# EAGLE design moire_v1.2_rt (EAGLE 9.2.0)

## Sheet 1 of 2
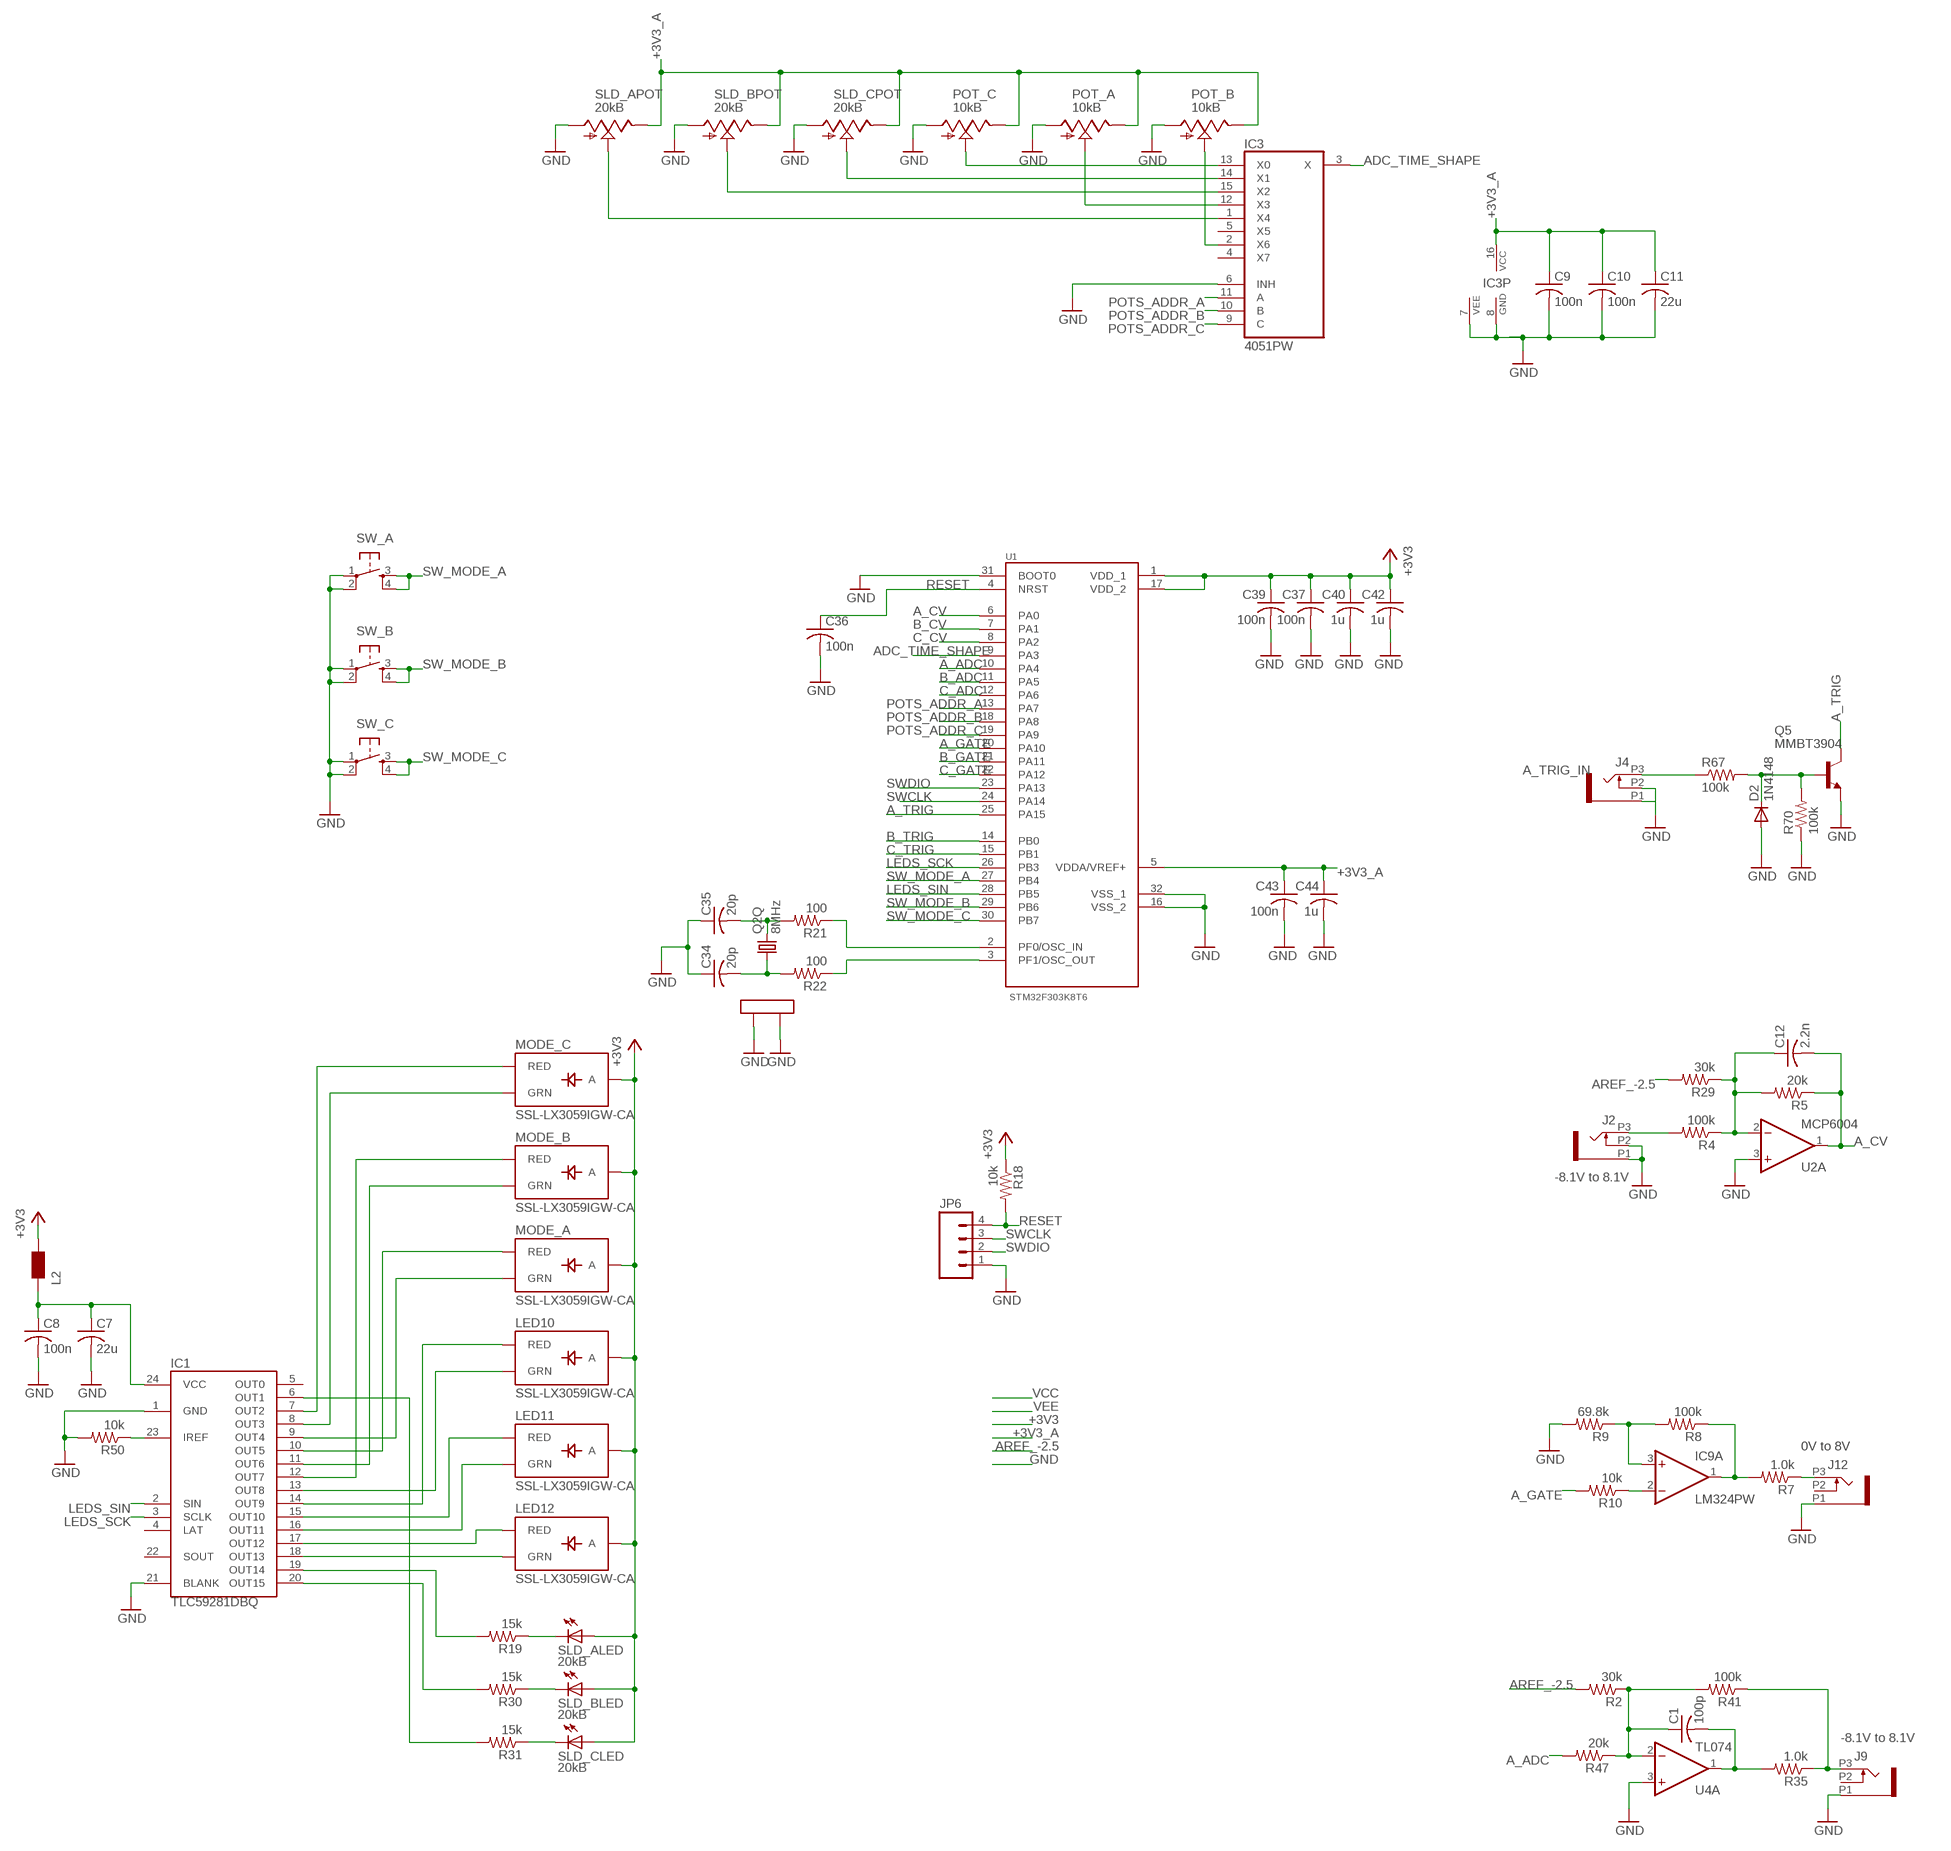
[diagram p0: schematic, sheet 1, part 1 of 2]
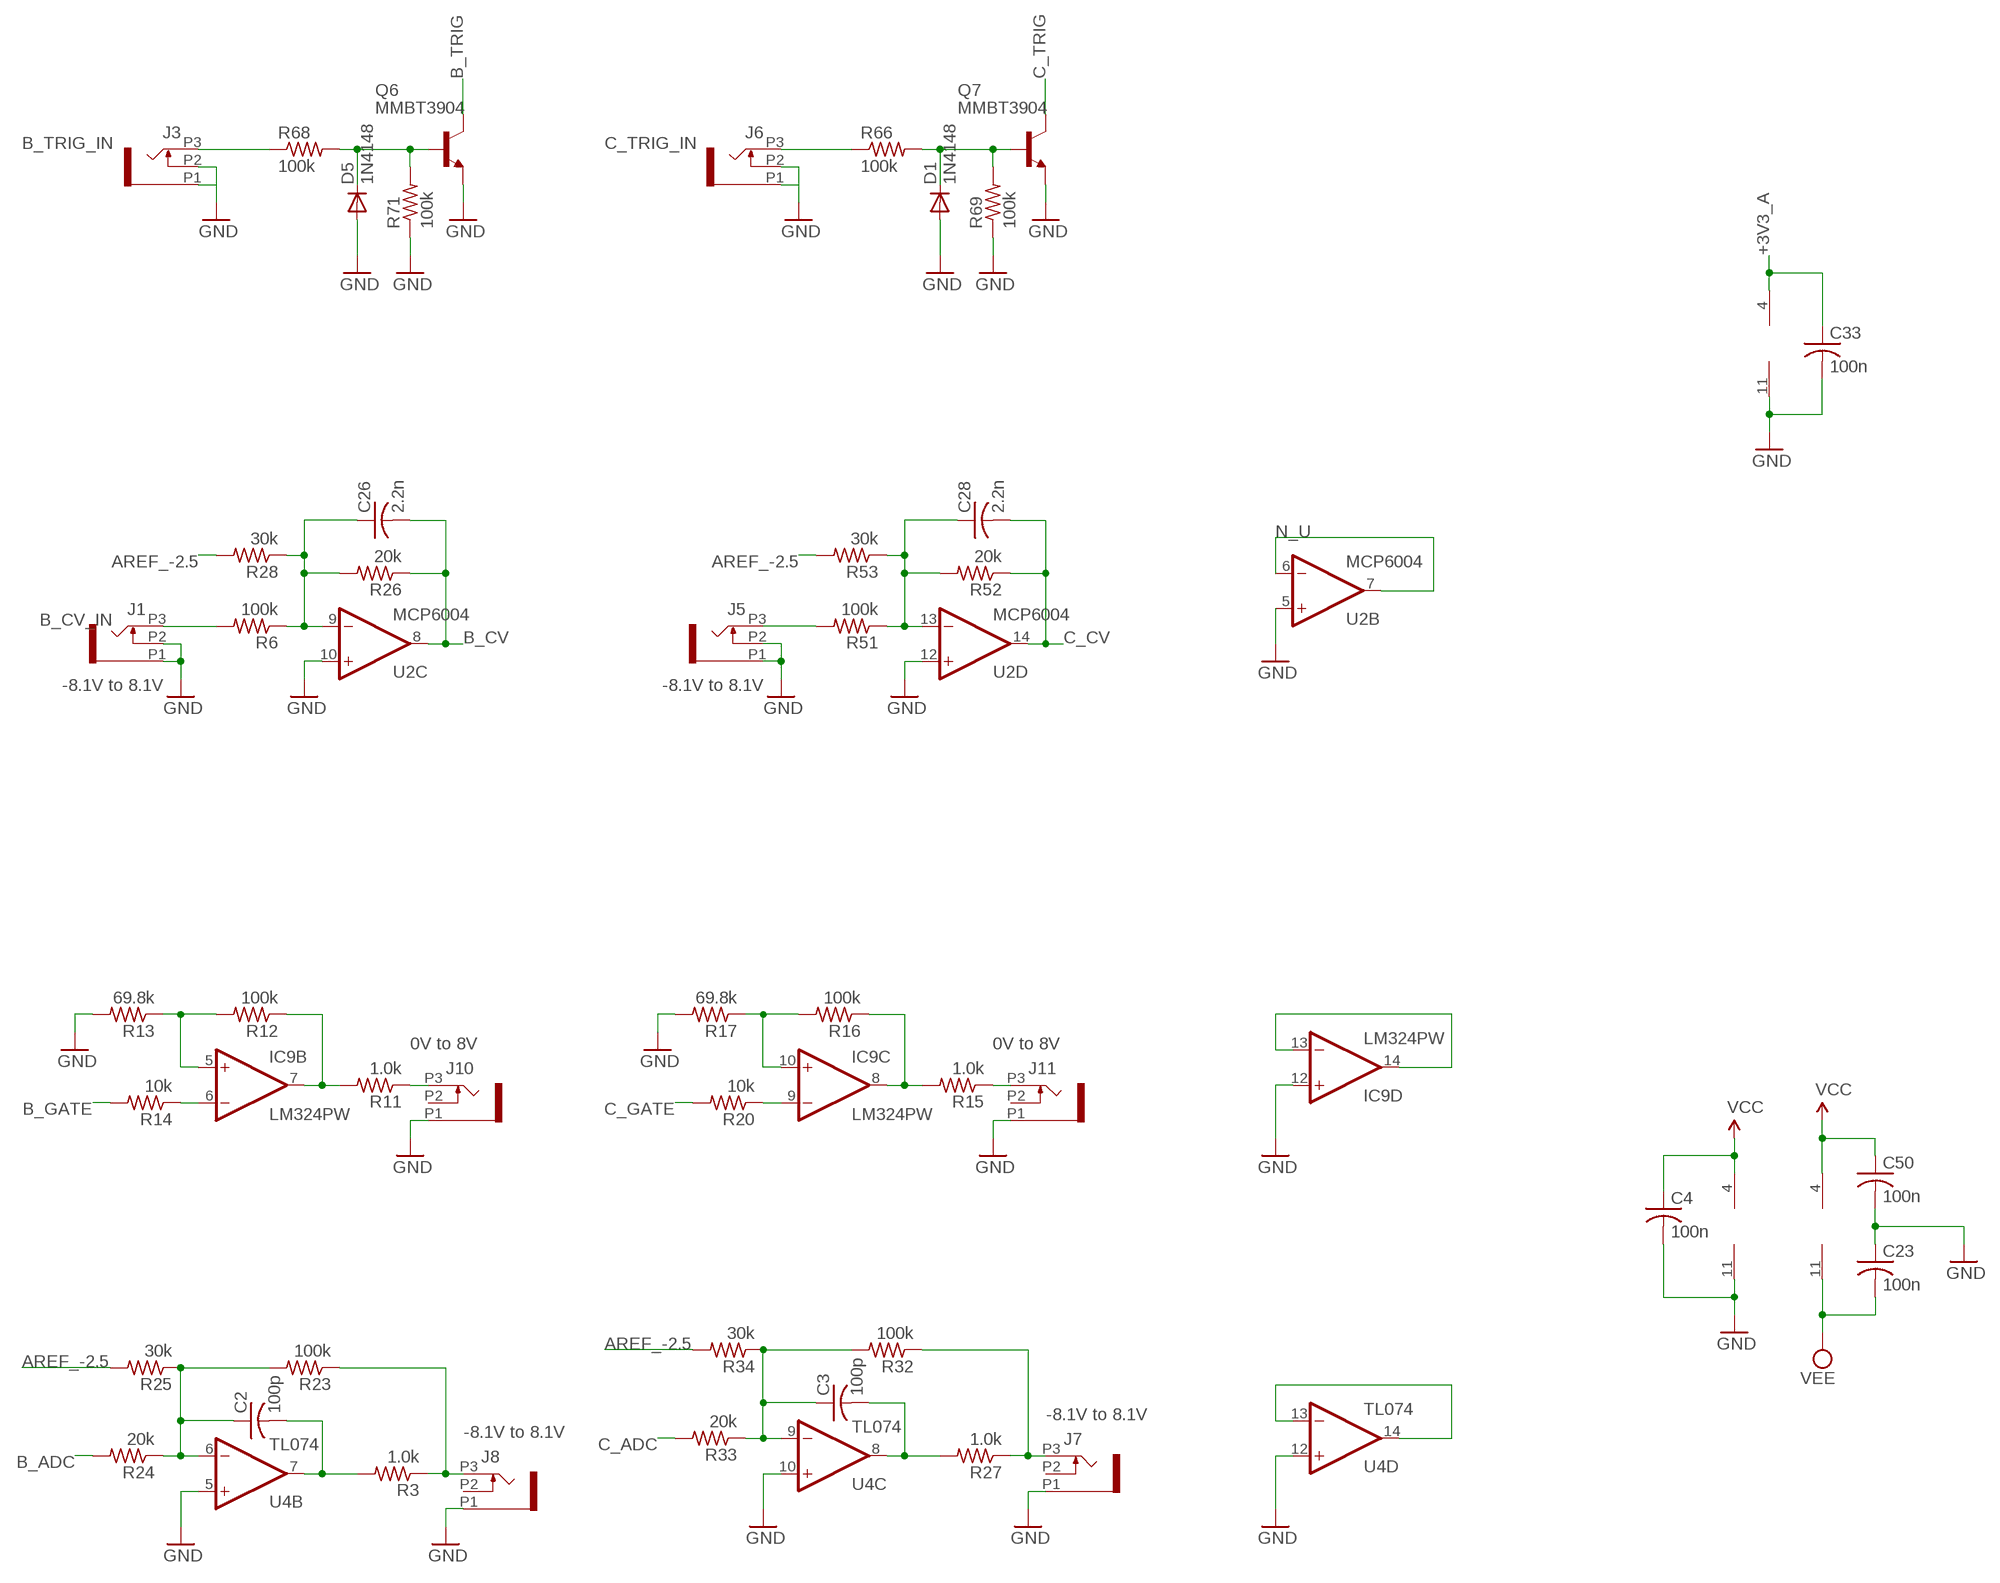
[diagram p1: schematic, sheet 1, part 2 of 2]

### Parts
C1  100p  C-USC0603  [C0603]
C2  100p  C-USC0603  [C0603]
C3  100p  C-USC0603  [C0603]
C4  100n  C-USC0603  [C0603]
C7  22u  C-USC1206  [C1206]
C8  100n  C-USC0603  [C0603]
C9  100n  C-USC0603  [C0603]
C10  100n  C-USC0603  [C0603]
C11  22u  C-USC1206  [C1206]
C12  2.2n  C-USC0603  [C0603]
C23  100n  C-USC0603  [C0603]
C26  2.2n  C-USC0603  [C0603]
C28  2.2n  C-USC0603  [C0603]
C33  100n  C-USC0603  [C0603]
C34  20p  C-USC0603  [C0603]
C35  20p  C-USC0603  [C0603]
C36  100n  C-USC0603  [C0603]
C37  100n  C-USC0603  [C0603]
C39  100n  C-USC0603  [C0603]
C40  1u  C-USC0603  [C0603]
C42  1u  C-USC0603  [C0603]
C43  100n  C-USC0603  [C0603]
C44  1u  C-USC0603  [C0603]
C50  100n  C-USC0603  [C0603]
D1  1N4148  DIODE-SOD523  [SOD523]
D2  1N4148  DIODE-SOD523  [SOD523]
D5  1N4148  DIODE-SOD523  [SOD523]
IC1  TLC59281DBQ  [TSSOP24_0635]
IC3  4051PW  [TSSOP16_065]
IC9  LM324PW  TL074PW  [TSSOP14_065]
J1  PJ301_THONKICONN6  [WQP_PJ_301M6]
J2  PJ301_THONKICONN6  [WQP_PJ_301M6]
J3  PJ301_THONKICONN6  [WQP_PJ_301M6]
J4  PJ301_THONKICONN6  [WQP_PJ_301M6]
J5  PJ301_THONKICONN6  [WQP_PJ_301M6]
J6  PJ301_THONKICONN6  [WQP_PJ_301M6]
J7  PJ301_THONKICONN6  [WQP_PJ_301M6]
J8  PJ301_THONKICONN6  [WQP_PJ_301M6]
J9  PJ301_THONKICONN6  [WQP_PJ_301M6]
J10  PJ301_THONKICONN6  [WQP_PJ_301M6]
J11  PJ301_THONKICONN6  [WQP_PJ_301M6]
J12  PJ301_THONKICONN6  [WQP_PJ_301M6]
JP6  M04PTH  [1X04]
L2  WE-CBF_0603  [0603]
LED10  SSL-LX3059IGW-CA  LED-BICOLOR-THROUGHHOLE-CA  [LED-BICOLOR-THROUGHHOLE-LUMEX]
LED11  SSL-LX3059IGW-CA  LED-BICOLOR-THROUGHHOLE-CA  [LED-BICOLOR-THROUGHHOLE-LUMEX]
LED12  SSL-LX3059IGW-CA  LED-BICOLOR-THROUGHHOLE-CA  [LED-BICOLOR-THROUGHHOLE-LUMEX]
MODE_A  SSL-LX3059IGW-CA  LED-BICOLOR-THROUGHHOLE-CA  [LED-BICOLOR-THROUGHHOLE-LUMEX]
MODE_B  SSL-LX3059IGW-CA  LED-BICOLOR-THROUGHHOLE-CA  [LED-BICOLOR-THROUGHHOLE-LUMEX]
MODE_C  SSL-LX3059IGW-CA  LED-BICOLOR-THROUGHHOLE-CA  [LED-BICOLOR-THROUGHHOLE-LUMEX]
POT_A  10kB  POT_USVERTICAL  [ALPS_POT_VERTICAL]
POT_B  10kB  POT_USVERTICAL  [ALPS_POT_VERTICAL]
POT_C  10kB  POT_USVERTICAL  [ALPS_POT_VERTICAL]
Q2  8MHz  CRYSTAL  [CTS406]
Q5  MMBT3904  MMBT3904LT1-NPN-SOT23-BEC  [SOT23-BEC]
Q6  MMBT3904  MMBT3904LT1-NPN-SOT23-BEC  [SOT23-BEC]
Q7  MMBT3904  MMBT3904LT1-NPN-SOT23-BEC  [SOT23-BEC]
R2  30k  R-US_R0603  [R0603]
R3  1.0k  R-US_R0603  [R0603]
R4  100k  R-US_R0603  [R0603]
R5  20k  R-US_R0603  [R0603]
R6  100k  R-US_R0603  [R0603]
R7  1.0k  R-US_R0603  [R0603]
R8  100k  R-US_R0603  [R0603]
R9  69.8k  R-US_R0603  [R0603]
R10  10k  R-US_R0603  [R0603]
R11  1.0k  R-US_R0603  [R0603]
R12  100k  R-US_R0603  [R0603]
R13  69.8k  R-US_R0603  [R0603]
R14  10k  R-US_R0603  [R0603]
R15  1.0k  R-US_R0603  [R0603]
R16  100k  R-US_R0603  [R0603]
R17  69.8k  R-US_R0603  [R0603]
R18  10k  R-US_R0603  [R0603]
R19  15k  R-US_R0603  [R0603]
R20  10k  R-US_R0603  [R0603]
R21  100  R-US_R0603  [R0603]
R22  100  R-US_R0603  [R0603]
R23  100k  R-US_R0603  [R0603]
R24  20k  R-US_R0603  [R0603]
R25  30k  R-US_R0603  [R0603]
R26  20k  R-US_R0603  [R0603]
R27  1.0k  R-US_R0603  [R0603]
R28  30k  R-US_R0603  [R0603]
R29  30k  R-US_R0603  [R0603]
R30  15k  R-US_R0603  [R0603]
R31  15k  R-US_R0603  [R0603]
R32  100k  R-US_R0603  [R0603]
R33  20k  R-US_R0603  [R0603]
R34  30k  R-US_R0603  [R0603]
R35  1.0k  R-US_R0603  [R0603]
R41  100k  R-US_R0603  [R0603]
R47  20k  R-US_R0603  [R0603]
R50  10k  R-US_R0603  [R0603]
R51  100k  R-US_R0603  [R0603]
R52  20k  R-US_R0603  [R0603]
R53  30k  R-US_R0603  [R0603]
R66  100k  R-US_R0603  [R0603]
R67  100k  R-US_R0603  [R0603]
R68  100k  R-US_R0603  [R0603]
R69  100k  R-US_R0603  [R0603]
R70  100k  R-US_R0603  [R0603]
R71  100k  R-US_R0603  [R0603]
SLD_A  20kB  BOURNS_SLIDER  [BOURNS_SLIDER]
SLD_B  20kB  BOURNS_SLIDER  [BOURNS_SLIDER]
SLD_C  20kB  BOURNS_SLIDER  [BOURNS_SLIDER]
SW_A  TAC_SWITCHPTH  [TACTILE-PTH]
SW_B  TAC_SWITCHPTH  [TACTILE-PTH]
SW_C  TAC_SWITCHPTH  [TACTILE-PTH]
U1  STM32F303K8T6  [QFP80P900X900X160-32N]
U2  MCP6004  MCP6004_SMD  [SO14]
U4  TL074  TL074_SMD  [SO14]

### Nets
+3V3: C37.1 C39.1 C40.1 C42.1 L2.2 LED10.A LED11.A LED12.A MODE_A.A MODE_B.A MODE_C.A R18.1 SLD_A.B(LED:A) SLD_B.B(LED:A) SLD_C.B(LED:A) U1.1(VDD_1) U1.17(VDD_2) ; also sheet 2
+3V3_A: C9.1 C10.1 C11.1 C33.1 C43.1 C44.1 IC3.16(VCC) POT_A.P$1(E) POT_B.P$1(E) POT_C.P$1(E) SLD_A.3(POT:E) SLD_B.3(POT:E) SLD_C.3(POT:E) U1.5(VDDA/VREF+) U2.4(P:V+) ; also sheet 2
A_ADC: R47.2 U1.10(PA4)
A_CV: C12.2 R5.1 U1.6(PA0) U2.1(A:OUT)
A_GATE: R10.2 U1.20(PA10)
A_TRIG: Q5.C U1.25(PA15)
A_TRIG_IN: J4.P3 R67.1
ADC_TIME_SHAPE: IC3.3(X) U1.9(PA3)
AREF_-2.5: R2.2 R25.2 R28.2 R29.2 R34.2 R53.2 ; also sheet 2
B_ADC: R24.2 U1.11(PA5)
B_CV: C26.2 R26.1 U1.7(PA1) U2.8(C:OUT)
B_CV_IN: J1.P3 R6.2
B_GATE: R14.2 U1.21(PA11)
B_TRIG: Q6.C U1.14(PB0)
B_TRIG_IN: J3.P3 R68.1
C_ADC: R33.2 U1.12(PA6)
C_CV: C28.2 R52.1 U1.8(PA2) U2.14(D:OUT)
C_GATE: R20.2 U1.22(PA12)
C_TRIG: Q7.C U1.15(PB1)
C_TRIG_IN: J6.P3 R66.1
GND: C4.2 C7.2 C8.2 C9.2 C10.2 C11.2 C23.1 C33.2 C34.1 C35.1 C36.2 C37.2 C39.2 C40.2 C42.2 C43.2 C44.2 C50.2 D1.A D2.A D5.A IC1.1(GND) IC1.21(BLANK) IC3.6(INH) IC3.7(VEE) IC3.8(GND) IC9.11(P:V-) IC9.12(D:+IN) J1.P1 J1.P2 J2.P1 J2.P2 J3.P1 J3.P2 J4.P1 J4.P2 J5.P1 J5.P2 J6.P1 J6.P2 J7.P1 J8.P1 J9.P1 J10.P1 J11.P1 J12.P1 JP6.1 POT_A.P$3(A) POT_B.P$3(A) POT_C.P$3(A) Q2.2(LID1) Q2.4(LID2) Q5.E Q6.E Q7.E R9.2 R13.2 R17.2 R50.2 R69.1 R70.1 R71.1 SLD_A.1(POT:A) SLD_B.1(POT:A) SLD_C.1(POT:A) SW_A.1 SW_A.2 SW_B.1 SW_B.2 SW_C.1 SW_C.2 U1.16(VSS_2) U1.31(BOOT0) U1.32(VSS_1) U2.3(A:+IN) U2.5(B:+IN) U2.10(C:+IN) U2.11(P:V-) U2.12(D:+IN) U4.3(A:+IN) U4.5(B:+IN) U4.10(C:+IN) U4.12(D:+IN) ; also sheet 2
LEDS_SCK: IC1.3(SCLK) U1.26(PB3)
LEDS_SIN: IC1.2(SIN) U1.28(PB5)
N$1: R31.1 SLD_C.E(LED:C)
N$2: J12.P3 R7.1
N$6: IC9.13(D:-IN) IC9.14(D:OUT)
N$7: J8.P3 R3.1 R23.1
N$8: C2.1 R23.2 R24.1 R25.1 U4.6(B:-IN)
N$9: R21.1 U1.2(PF0/OSC_IN)
N$10: R22.1 U1.3(PF1/OSC_OUT)
N$11: C35.2 Q2.3 R21.2
N$12: C34.2 Q2.1 R22.2
N$13: J10.P3 R11.1
N$14: U4.13(D:-IN) U4.14(D:OUT)
N$15: C2.2 R3.2 U4.7(B:OUT)
N$16: IC9.1(A:OUT) R7.2 R8.1
N$17: J7.P3 R27.1 R32.1
N$18: C3.1 R32.2 R33.1 R34.1 U4.9(C:-IN)
N$19: C3.2 R27.2 U4.8(C:OUT)
N$20: J11.P3 R15.1
N$21: J5.P3 R51.2
N$22: J2.P3 R4.2
N$24: IC9.3(A:+IN) R8.2 R9.1
N$25: IC9.2(A:-IN) R10.1
N$26: IC9.7(B:OUT) R11.2 R12.1
N$28: IC9.5(B:+IN) R12.2 R13.1
N$29: IC9.6(B:-IN) R14.1
N$30: IC9.8(C:OUT) R15.2 R16.1
N$32: IC1.11(OUT6) MODE_B.GREEN_C(GRN)
N$33: IC1.10(OUT5) MODE_A.RED_C(RED)
N$34: IC1.12(OUT7) MODE_B.RED_C(RED)
N$35: IC1.7(OUT2) MODE_C.RED_C(RED)
N$36: IC1.8(OUT3) MODE_C.GREEN_C(GRN)
N$37: IC1.15(OUT10) LED11.RED_C(RED)
N$38: IC1.16(OUT11) LED11.GREEN_C(GRN)
N$39: IC1.13(OUT8) LED10.GREEN_C(GRN)
N$40: IC1.17(OUT12) LED12.RED_C(RED)
N$41: D1.C Q7.B R66.2 R69.2
N$42: IC1.18(OUT13) LED12.GREEN_C(GRN)
N$43: IC1.14(OUT9) LED10.RED_C(RED)
N$44: C7.1 C8.1 IC1.24(VCC) L2.1
N$45: IC1.19(OUT14) R19.2
N$46: IC1.20(OUT15) R30.2
N$47: IC1.6(OUT1) R31.2
N$48: IC3.1(X4) SLD_A.2(POT:S)
N$49: R30.1 SLD_B.E(LED:C)
N$50: R19.1 SLD_A.E(LED:C)
N$51: IC3.2(X6) POT_B.P$2(S)
N$53: IC3.12(X3) POT_A.P$2(S)
N$54: IC3.13(X0) POT_C.P$2(S)
N$55: IC3.14(X1) SLD_C.2(POT:S)
N$56: IC3.15(X2) SLD_B.2(POT:S)
N$57: C12.1 R4.1 R5.2 R29.1 U2.2(A:-IN)
N$58: C26.1 R6.1 R26.2 R28.1 U2.9(C:-IN)
N$59: C28.1 R51.1 R52.2 R53.1 U2.13(D:-IN)
N$61: IC9.10(C:+IN) R16.2 R17.1
N$62: D5.C Q6.B R68.2 R71.2
N$64: IC9.9(C:-IN) R20.1
N$65: D2.C Q5.B R67.2 R70.2
N$68: IC1.23(IREF) R50.1
N$86: J9.P3 R35.1 R41.1
N$87: C1.1 R2.1 R41.2 R47.1 U4.2(A:-IN)
N$93: C1.2 R35.2 U4.1(A:OUT)
N$101: IC1.9(OUT4) MODE_A.GREEN_C(GRN)
N_U: U2.6(B:-IN) U2.7(B:OUT)
POTS_ADDR_A: IC3.11(A) U1.13(PA7)
POTS_ADDR_B: IC3.10(B) U1.18(PA8)
POTS_ADDR_C: IC3.9(C) U1.19(PA9)
RESET: C36.1 JP6.4 R18.2 U1.4(NRST)
SW_MODE_A: SW_A.3 SW_A.4 U1.27(PB4)
SW_MODE_B: SW_B.3 SW_B.4 U1.29(PB6)
SW_MODE_C: SW_C.3 SW_C.4 U1.30(PB7)
SWCLK: JP6.3 U1.24(PA14)
SWDIO: JP6.2 U1.23(PA13)
VCC: C4.1 C50.1 IC9.4(P:V+) U4.4(P:V+) ; also sheet 2
VEE: C23.2 U4.11(P:V-) ; also sheet 2
Unconnected: IC1.4(LAT) IC1.5(OUT0) IC1.22(SOUT) IC3.4(X7) IC3.5(X5) J7.P2 J8.P2 J9.P2 J10.P2 J11.P2 J12.P2

### Notes on the sheet
- -8.1V to 8.1V | -8.1V to 8.1V | -8.1V to 8.1V
- 0V to 8V | 0V to 8V | 0V to 8V
- -8.1V to 8.1V
- -8.1V to 8.1V | -8.1V to 8.1V

## Sheet 2 of 2
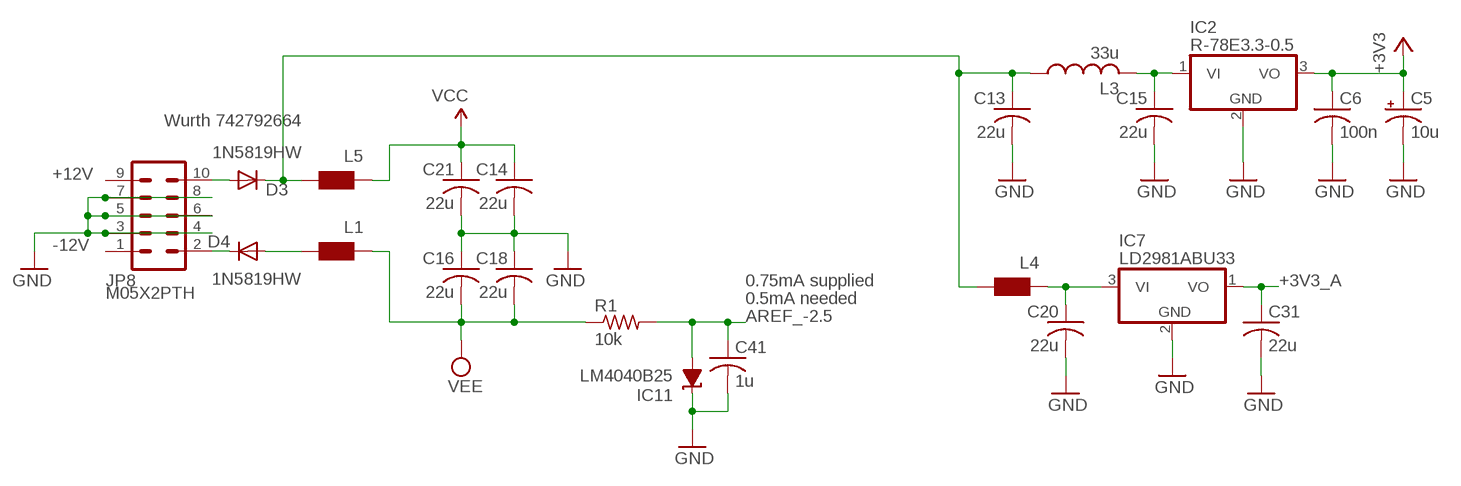
[diagram p2: schematic, sheet 2]

### Parts
C5  10u  CPOL-USA  [PANASONIC_A]
C6  100n  C-USC0603  [C0603]
C13  22u  C-USC1206  [C1206]
C14  22u  C-USC1206  [C1206]
C15  22u  C-USC1206  [C1206]
C16  22u  C-USC1206  [C1206]
C18  22u  C-USC1206  [C1206]
C20  22u  C-USC1206  [C1206]
C21  22u  C-USC1206  [C1206]
C31  22u  C-USC1206  [C1206]
C41  1u  C-USC0603  [C0603]
D3  1N5819HW  DIODE-SOD123  [SOD123]
D4  1N5819HW  DIODE-SOD123  [SOD123]
IC2  R-78E3.3-0.5  WE173950378  [WE78]
IC7  LD2981ABU33  LD2981ABU  [SOT89]
IC11  LM4040B25  LM4041B12DBZ  [DBZ_R-PDSO-G3]
JP8  M05X2PTH  [2X5-PTH]
L1  WE-CBF_0603  [0603]
L3  33u  L-USL2012C  [L2012C]
L4  WE-CBF_0603  [0603]
L5  WE-CBF_0603  [0603]
R1  10k  R-US_R0603  [R0603]

### Nets
+3V3: C5.+ C6.1 IC2.3(VO) ; also sheet 1
+3V3_A: C31.1 IC7.1(VO) ; also sheet 1
+12V: D3.A JP8.9 JP8.10
-12V: D4.C JP8.1 JP8.2
AREF_-2.5: C41.1 IC11.2(A) R1.2 ; also sheet 1
GND: C5.- C6.2 C13.2 C14.2 C15.2 C16.1 C18.1 C20.2 C21.2 C31.2 C41.2 IC2.2(GND) IC7.2(GND) IC11.1(C) JP8.3 JP8.4 JP8.5 JP8.6 JP8.7 JP8.8 ; also sheet 1
N$3: D4.A L1.2
N$4: C13.1 D3.C L3.1 L4.2 L5.2
N$5: C20.1 IC7.3(VI) L4.1
N$66: C15.1 IC2.1(VI) L3.2
VCC: C14.1 C21.1 L5.1 ; also sheet 1
VEE: C16.2 C18.2 L1.1 R1.1 ; also sheet 1

### Notes on the sheet
- Wurth 742792664
- 0.75mA supplied
- 0.5mA needed

## Library data of the parts
C1-C4 C6-C16 C18 C20 C21 C23 C26 C28 C31 C33-C37 C39-C44 C50 = rcl:C-US: CAPACITOR, American symbol
C5 = rcl:CPOL-US: POLARIZED CAPACITOR, American symbol
D1-D5 = diode:DIODE-: DIODE
IC1 = og-ics:TLC59281
IC2 = og-vreg:WE173950378
IC3 = og-ics:4051: 8-channel ANALOG MULTIPLEXER
IC7 = og-vreg:LD2981
IC9 = og-linear:TL074: OP AMP
IC11 = texas:LM4041: PRECISION MICROPOWER SHUNT VOLTAGE REFERENCE Source: http://focus.ti.com/lit/ds/slcs146e/slcs146e.pdf
J1-J12 = og-pj301_variations:PJ301_THONKICONN
JP6 = SparkFun:M04: Header 4 Standard 4-pin 0.1" header. Use with straight break away headers (SKU : PRT-00116), right angle break away headers (PRT-00553), swiss pins (PRT-00743), machine pins (PRT-00117), and female headers (PRT-00115). Molex polarized connector foot print use with SKU : PRT-08231 with associated crimp pins and housings.
JP8 = og-header:M05X2: Header 5x2 Standard 10-pin dual row 0.1" header. Commonly used with AVR-ISP. Use with Spark Fun Electronics SKU: PRT-00778
L1 L2 L4 L5 = wuerth-elektronik:WE-CBF: SMD EMI Suppression Ferrite Beads - excellent anti-EMI properties - low DCR - impedances till 3000 ohms - rated current up to 6 A
L3 = og-rcl:L-US
LED10-LED12 MODE_A MODE_B MODE_C = og-leds:LED-BICOLOR-THROUGHHOLE-CA
POT_A POT_B POT_C = og-pots:POT_US
Q2 = og-crystal:CRYSTAL: Crystal with 2 extra terminals for the metal LID (Abracon ABMM2 for example)
Q5-Q7 = transistor:*-NPN-: NPN Transistror BF959 corrected 2008.03.06
R1-R35 R41 R47 R50-R53 R66-R71 = rcl:R-US_: RESISTOR, American symbol
SLD_A SLD_B SLD_C = og-pots:BOURNS_SLIDER
SW_A SW_B SW_C = SparkFun:TAC_SWITCH: Momentary Switch Button commonly used for reset or general input. Spark Fun Electronics SKU : COM-00097
U1 = STM32F303K8T6:STM32F303K8T6: Analog and DSP with FPU ARM Cortex-M4 MCU with 64 Kbytes Flash, 72 MHz CPU, CCM, 12-bit ADC 5 MSPS, comparators, op-amp; AVAILABILITY: Unavailable; DESCRIPTION: Analog and DSP with FPU ARM Cortex-M4 MCU with 64 Kbytes Flash, 72 MHz CPU, CCM, 12-bit ADC 5 MSPS, comparators, op-amp; MF: STMicroelectronics; MP: STM32F303K8T6; PACKAGE: LQFP-32 STMicroelectronics; PRICE: None
U2 = MusicThingModular:MCP6004: Generic Quad Op Amp
U4 = MusicThingModular:TL074: Generic Quad Op Amp

## Board
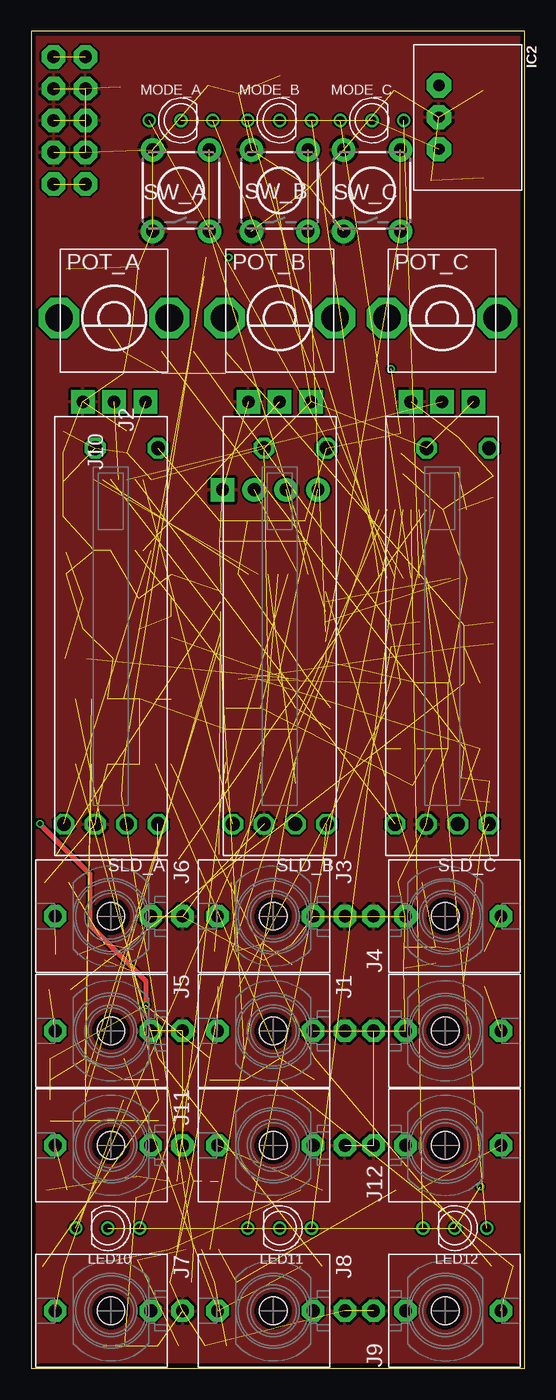
[diagram p3: board, top side]
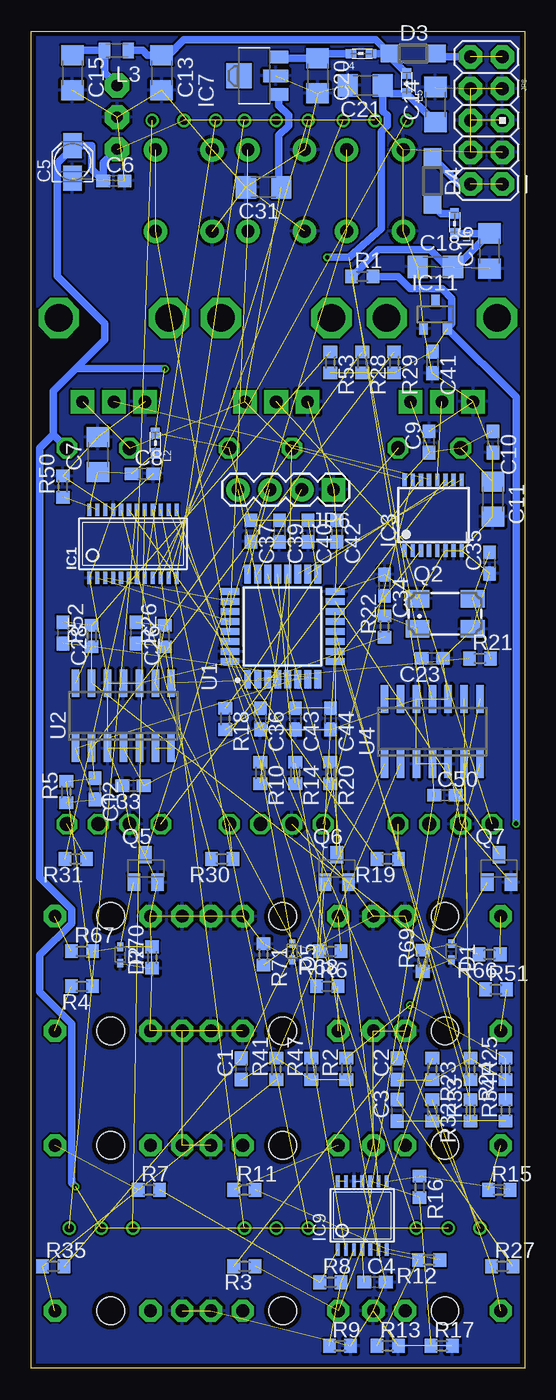
[diagram p4: board, bottom side, seen from below]

Size 39.35 x 106.68 mm. Coordinates in mm from the lower left corner, seen from the top.
Outline: 0,0 39.35,0 39.35,106.68 0,106.68 0,0
Copper layers (1*16): Top 0.035559375mm / dielectric 1.6mm / Bottom 0.035559375mm
Design rules "oshpark-2layer *": minimum track width 6mil, minimum drill 10mil, track to track 6mil, track to pad 6mil, pad to pad 6mil, via to via 6mil, smd to smd 0mil, copper to edge 15mil, drill to drill 6mil, minimum pad ring 5mil, minimum via ring 5mil, stop-mask expansion 2.5mil, vias tented up to drill 0mil, thermal gap 10mil

### Footprints (pad centres in the part's own frame; a part is rotated, then mirrored left to right if it is on the bottom)
C0603 = smd 1.1 x 1: 1 -0.85,0; 2 0.85,0
PANASONIC_A = smd 2 x 1.5: + 1.3,0; - -1.3,0
C1206 = smd 1.6 x 1.8: 1 -1.4,0; 2 1.4,0
SOD523 = smd 0.7 x 0.5: A 0.7,0; C -0.6,0
SOD123 = smd 1.4 x 1.4: A 1.9,0; C -1.9,0
TSSOP24_0635 = smd 0.33 x 1: 1 -3.493,-2.725; 2 -2.857,-2.725; 3 -2.223,-2.725; 4 -1.587,-2.725; 5 -0.953,-2.725; 6 -0.318,-2.725; 7 0.318,-2.725; 8 0.953,-2.725; 9 1.587,-2.725; 10 2.223,-2.725; 11 2.857,-2.725; 12 3.493,-2.725; 13 3.493,2.725; 14 2.857,2.725; 15 2.223,2.725; 16 1.587,2.725; 17 0.953,2.725; 18 0.318,2.725; 19 -0.318,2.725; 20 -0.953,2.725; 21 -1.587,2.725; 22 -2.223,2.725; 23 -2.857,2.725; 24 -3.493,2.725
WE78 = drill 0.9 pad 1.93 octagon: 1 -2.54,0; 2 0,0; 3 2.54,0
TSSOP16_065 = smd 0.35 x 1: 1 -1.95,-2.825; 2 -1.3,-2.825; 3 -0.65,-2.825; 4 0,-2.825; 5 0.65,-2.825; 6 1.3,-2.825; 7 1.95,-2.825; 8 2.6,-2.825; 9 2.6,2.825; 10 1.95,2.825; 11 1.3,2.825; 12 0.65,2.825; 13 0,2.825; 14 -0.65,2.825; 15 -1.3,2.825; 16 -1.95,2.825
SOT89 = smd 1 x 1.5: 1 -1.499,-1.981; 3 1.499,-1.981 | smd 1 x 2: 2 0,-1.727 | smd 2 x 2: 2@1 0,1.194
TSSOP14_065 = smd 0.305 x 0.991: 1 -1.95,-2.718; 2 -1.3,-2.718; 3 -0.65,-2.718; 4 0,-2.718; 5 0.65,-2.718; 6 1.3,-2.718; 7 1.95,-2.718; 8 1.95,2.718; 9 1.3,2.718; 10 0.65,2.718; 11 0,2.718; 12 -0.65,2.718; 13 -1.3,2.718; 14 -1.95,2.718
DBZ_R-PDSO-G3 = smd 0.7 x 1: 1 -0.95,-1.1; 2 0.95,-1.1; 3 0,1.1
WQP_PJ_301M6 = drill 1.016 pad 1.778 octagon: P1 0,-5.715; P2 0,-3.175; P3 0,4.445 | hole 2.2: 0,0
1X04 = drill 1.016 pad 1.88 square: 1 0,0 | drill 1.016 pad 1.88: 2 2.54,0; 3 5.08,0; 4 7.62,0
2X5-PTH = drill 1.016 pad 1.88 octagon: 1 -1.27,5.08; 2 1.27,5.08; 3 -1.27,2.54; 4 1.27,2.54; 5 -1.27,0; 6 1.27,0; 7 -1.27,-2.54; 8 1.27,-2.54; 9 -1.27,-5.08; 10 1.27,-5.08
0603 = smd 0.85 x 0.7: 1 -0.9,0; 2 0.7,0
L2012C = smd 0.9 x 1.25: 1 -0.9,0; 2 1,0
LED-BICOLOR-THROUGHHOLE-LUMEX = drill 0.7: A 0,0; GREEN_C 2.54,0; RED_C -2.54,0
ALPS_POT_VERTICAL = drill 1 pad 1.88 square: P$1 -2.5,6.7; P$2 0,6.7; P$3 2.5,6.7 | drill 2.2 pad 3.175 octagon: P$4 -4.4,0; P$5 4.4,0
CTS406 = smd 1.9 x 1.4: 1 -2.2,-1.2; 2 2.2,-1.2; 3 2.2,1.2; 4 -2.2,1.2
SOT23-BEC = smd 1 x 1.4: B -0.95,-1.1; C 0,1.1; E 0.95,-1.1
R0603 = smd 1 x 1.1: 1 -0.85,0; 2 0.85,0
BOURNS_SLIDER = drill 1.1 octagon: 1 -15,1.25; 2 -15,3.75; 3 15,1.25; B 15,-3.75; DUMMY -15,-1.25; E -15,-3.75
TACTILE-PTH = drill 1.016 pad 1.88: 1 -3.251,2.261; 2 3.251,2.261; 3 -3.251,-2.261; 4 3.251,-2.261
QFP80P900X900X160-32N = smd 1.5 x 0.55: 1 -4.2,2.8; 2 -4.2,2; 3 -4.2,1.2; 4 -4.2,0.4; 5 -4.2,-0.4; 6 -4.2,-1.2; 7 -4.2,-2; 8 -4.2,-2.8; 17 4.2,-2.8; 18 4.2,-2; 19 4.2,-1.2; 20 4.2,-0.4; 21 4.2,0.4; 22 4.2,1.2; 23 4.2,2; 24 4.2,2.8 | smd 0.55 x 1.5: 9 -2.8,-4.2; 10 -2,-4.2; 11 -1.2,-4.2; 12 -0.4,-4.2; 13 0.4,-4.2; 14 1.2,-4.2; 15 2,-4.2; 16 2.8,-4.2; 25 2.8,4.2; 26 2,4.2; 27 1.2,4.2; 28 0.4,4.2; 29 -0.4,4.2; 30 -1.2,4.2; 31 -2,4.2; 32 -2.8,4.2
SO14 = smd 0.6 x 2.2: 1 -3.81,-2.6; 2 -2.54,-2.6; 3 -1.27,-2.6; 4 0,-2.6; 5 1.27,-2.6; 6 2.54,-2.6; 7 3.81,-2.6; 8 3.81,2.6; 9 2.54,2.6; 10 1.27,2.6; 11 0,2.6; 12 -1.27,2.6; 13 -2.54,2.6; 14 -3.81,2.6

### Placement (x,y rotation side)
C1  22.61,23.88 90 bottom
C2  10.16,23.88 90 bottom
C3  10.16,20.57 90 bottom
C4  11.94,6.86 0 bottom
C5  36.07,96.27 90 bottom
C6  32.77,94.74 0 bottom
C7  34.04,72.9 90 bottom
C8  30.48,71.37 0 bottom
C9  7.62,73.91 90 bottom
C10  2.54,73.91 270 bottom
C11  2.54,69.34 270 bottom
C12  34.29,46.23 270 bottom
C13  28.96,103.38 270 bottom
C14  7.11,100.84 90 bottom
C15  36.07,103.38 270 bottom
C16  2.79,89.15 90 bottom
C18  7.11,87.88 0 bottom
C20  16.51,103.12 270 bottom
C21  12.7,102.36 180 bottom
C23  7.37,56.64 180 bottom
C26  30.99,58.67 270 bottom
C28  36.83,58.67 270 bottom
C31  20.83,94.23 180 bottom
C33  31.24,46.48 180 bottom
C34  11.18,62.48 270 bottom
C35  2.79,64.26 90 bottom
C36  21.08,51.82 270 bottom
C37  21.84,66.8 270 bottom
C39  19.56,66.8 270 bottom
C40  17.27,66.8 270 bottom
C41  7.37,80.26 270 bottom
C42  14.99,66.8 270 bottom
C43  18.29,51.82 270 bottom
C44  15.49,51.82 270 bottom
C50  6.35,45.72 0 bottom
D1  5.84,33.27 270 bottom
D2  32.26,33.02 270 bottom
D3  8.89,104.9 0 bottom
D4  7.37,94.74 270 bottom
D5  18.54,33.27 270 bottom
IC1  31.24,65.79 0 bottom
IC2  32.51,99.82 270 top
IC3  7.62,68.07 0 bottom
IC7  21.59,103.12 90 bottom
IC9  12.95,12.19 0 bottom
IC11  7.11,84.07 0 bottom
J1  19.3,26.92 90 top
J2  33.02,26.92 270 top
J3  19.3,36.07 90 top
J4  33.02,36.07 270 top
J5  6.35,26.92 90 top
J6  6.35,36.07 90 top
J7  6.35,4.57 90 top
J8  19.3,4.57 90 top
J9  33.02,4.57 270 top
J10  19.3,17.78 90 top
J11  6.35,17.78 90 top
J12  33.02,17.78 270 top
JP6  15.24,70.1 180 bottom
JP8  3.05,99.57 180 bottom
L1  5.59,91.44 90 bottom
L2  29.46,73.91 90 bottom
L3  32.51,105.16 180 bottom
L4  12.95,104.9 0 bottom
L5  9.4,102.62 90 bottom
LED10  6.1,11.18 0 top
LED11  19.81,11.18 0 top
LED12  33.78,11.18 0 top
MODE_A  11.94,99.57 180 top
MODE_B  19.81,99.57 180 top
MODE_C  27.18,99.57 180 top
POT_A  6.6,83.82 180 top
POT_B  19.81,83.82 180 top
POT_C  32.77,83.82 180 top
Q2  6.35,60.2 0 bottom
Q5  30.23,39.88 0 bottom
Q6  14.99,39.88 0 bottom
Q7  2.03,39.88 0 bottom
R1  12.95,87.12 0 bottom
R2  14.22,23.88 90 bottom
R3  22.35,8.13 180 bottom
R4  35.31,30.48 180 bottom
R5  36.58,45.97 90 bottom
R6  15.75,30.48 0 bottom
R7  29.97,14.22 0 bottom
R8  15.49,6.86 0 bottom
R9  14.73,1.78 0 bottom
R10  21.08,47.5 270 bottom
R11  22.35,14.22 0 bottom
R12  7.62,8.64 180 bottom
R13  10.92,1.78 0 bottom
R14  18.29,47.5 270 bottom
R15  2.03,14.22 0 bottom
R16  8.38,14.48 270 bottom
R17  6.6,1.78 0 bottom
R18  23.88,51.82 270 bottom
R19  10.92,40.64 180 bottom
R20  15.49,47.5 270 bottom
R21  3.56,56.64 0 bottom
R22  11.18,59.18 90 bottom
R23  7.37,23.88 270 bottom
R24  4.32,23.88 270 bottom
R25  1.52,23.88 90 bottom
R26  28.7,58.42 90 bottom
R27  1.78,8.13 0 bottom
R28  12.95,80.26 270 bottom
R29  10.41,80.26 270 bottom
R30  24.13,40.64 180 bottom
R31  35.81,40.64 180 bottom
R32  7.37,20.57 270 bottom
R33  4.32,20.57 90 bottom
R34  1.52,20.57 90 bottom
R35  37.59,8.13 0 bottom
R41  19.81,23.88 90 bottom
R47  17.02,23.88 90 bottom
R50  36.83,70.36 90 bottom
R51  2.29,30.23 0 bottom
R52  34.54,58.42 90 bottom
R53  15.49,80.26 270 bottom
R66  2.79,33.02 180 bottom
R67  35.31,33.27 0 bottom
R68  15.49,33.27 180 bottom
R69  8.13,32.51 90 bottom
R70  29.72,32.77 90 bottom
R71  20.83,33.02 270 bottom
SLD_A  6.35,58.42 90 top
SLD_B  19.81,58.42 90 top
SLD_C  32.77,58.42 90 top
SW_A  11.94,93.98 90 top
SW_B  19.81,93.98 90 top
SW_C  27.18,93.98 90 top
U1  19.3,59.18 90 bottom
U2  32,52.07 0 bottom
U4  7.37,50.8 0 bottom

### Tracks (layer width: path | path; a pad name or v marks a point on that pad's centre or on a via)
+3V3  (via drill 0.35)  (16 unrouted)
  Bottom 0.61: IC2.3 33.62,96.18 C6.1 34.54,95.67 34.54,97.54 36.04,97.54 C5.+ 36.07,97.36 37.27,96.16 37.27,87.13 33.49,83.35 33.49,82.08 35.76,79.81 | 35.76,79.81 37.59,77.98 37.59,74.5 | 37.59,74.5 SLD_C.B | 37.59,74.5 38.66,73.42 38.66,39.17 36.12,36.63 36.12,35.51 38.66,32.97 38.66,30.03 36.12,27.48 36.12,14.78 v35.81,14.48 | 35.76,79.81 35.65,79.76 v28.7,79.76
+3V3_A  (15 unrouted)
  Bottom 0.61: C31.1 19.61,94.42 19.61,98.38 18.83,99.16 18.83,99.97 19.61,100.75 IC7.1
+12V  (1 unrouted)
  Bottom 0.61: JP8.10 6.74,104.65 D3.A
-12V  (1 unrouted)
  Bottom 0.61: JP8.2 5.21,94.49 D4.C
A_ADC  (1 unrouted)
A_CV  (3 unrouted)
A_GATE  (1 unrouted)
A_TRIG  (1 unrouted)
A_TRIG_IN  (1 unrouted)
ADC_TIME_SHAPE  (1 unrouted)
AREF_-2.5  (via drill 0.35)  (8 unrouted)
  Top 0.406: v0.68,43.43 4.67,39.45 4.67,35.37 9.14,30.89 v9.14,28.96
  Bottom 0.61: R1.2 10.1,87.12 9.11,86.13 6.57,86.13 5.8,85.36 5.8,83.34 IC11.2 0.69,77.5 v0.69,43.43
B_ADC  (1 unrouted)
B_CV  (3 unrouted)
B_CV_IN  (1 unrouted)
B_GATE  (1 unrouted)
B_TRIG  (1 unrouted)
B_TRIG_IN  (1 unrouted)
C_ADC  (1 unrouted)
C_CV  (3 unrouted)
C_GATE  (1 unrouted)
C_TRIG  (1 unrouted)
C_TRIG_IN  (1 unrouted)
GND  (102 unrouted)
  pour Bottom: 39.62,106.93 0,106.93 -0.76,106.17 -0.76,-0.25 0,-1.02 0.25,-1.02 38.86,-1.02 39.62,-0.25 39.62,106.68
  pour Top: 0,-1.78 39.37,-1.78 40.39,-0.76 40.39,107.19 39.62,107.95 -0.25,107.95 -2.03,106.17 -2.03,0.25
LEDS_SCK  (1 unrouted)
LEDS_SIN  (1 unrouted)
N$1  (1 unrouted)
N$2  (1 unrouted)
N$3
  Bottom 0.61: D4.A 6.66,92.14 L1.2
N$4
  Bottom 0.61: D3.C L4.2 | D3.C 10.79,104.71 L5.2 | D3.C 11.88,105.99 27.18,105.99 28.39,104.78 C13.1 30.1,104.78 30.48,105.16 L3.1
N$5
  Bottom 0.61: L4.1 16.13,104.9 C20.1 19.51,104.52 IC7.3
N$6  (1 unrouted)
N$7  (2 unrouted)
N$8  (4 unrouted)
N$9  (1 unrouted)
N$10  (1 unrouted)
N$11  (2 unrouted)
N$12  (2 unrouted)
N$13  (1 unrouted)
N$14  (1 unrouted)
N$15  (2 unrouted)
N$16  (2 unrouted)
N$17  (2 unrouted)
N$18  (4 unrouted)
N$19  (2 unrouted)
N$20  (1 unrouted)
N$21  (1 unrouted)
N$22  (1 unrouted)
N$24  (2 unrouted)
N$25  (1 unrouted)
N$26  (2 unrouted)
N$28  (2 unrouted)
N$29  (1 unrouted)
N$30  (2 unrouted)
N$32  (1 unrouted)
N$33  (1 unrouted)
N$34  (1 unrouted)
N$35  (1 unrouted)
N$36  (1 unrouted)
N$37  (1 unrouted)
N$38  (1 unrouted)
N$39  (1 unrouted)
N$40  (1 unrouted)
N$41  (3 unrouted)
N$42  (1 unrouted)
N$43  (1 unrouted)
N$44  (3 unrouted)
N$45  (1 unrouted)
N$46  (1 unrouted)
N$47  (1 unrouted)
N$48  (1 unrouted)
N$49  (1 unrouted)
N$50  (1 unrouted)
N$51  (1 unrouted)
N$53  (1 unrouted)
N$54  (1 unrouted)
N$55  (1 unrouted)
N$56  (1 unrouted)
N$57  (4 unrouted)
N$58  (4 unrouted)
N$59  (4 unrouted)
N$61  (2 unrouted)
N$62  (3 unrouted)
N$64  (1 unrouted)
N$65  (3 unrouted)
N$66
  Bottom 0.61: C15.1 35.69,105.16 L3.2 33.51,103.36 IC2.1
N$68  (1 unrouted)
N$86  (2 unrouted)
N$87  (4 unrouted)
N$93  (2 unrouted)
N$101  (1 unrouted)
N_U  (1 unrouted)
POTS_ADDR_A  (1 unrouted)
POTS_ADDR_B  (1 unrouted)
POTS_ADDR_C  (1 unrouted)
RESET  (3 unrouted)
SW_MODE_A  (2 unrouted)
SW_MODE_B  (2 unrouted)
SW_MODE_C  (2 unrouted)
SWCLK  (1 unrouted)
SWDIO  (1 unrouted)
VCC  (via drill 0.35)  (4 unrouted)
  Bottom 0.61: C14.1 L5.1 10.65,101.72 C21.1 11.3,100.32 10.96,99.97 10.96,99.16 11.43,98.69 11.43,90.93 13.97,88.65 v15.75,88.65
VEE  (2 unrouted)
  Bottom 0.61: L1.1 2.81,90.54 C16.2 5.46,87.88 C18.2 6.17,87.88 7.52,89.24 11.69,89.24 R1.1